# Altium schematic sheet STM32.SchDoc
size A4
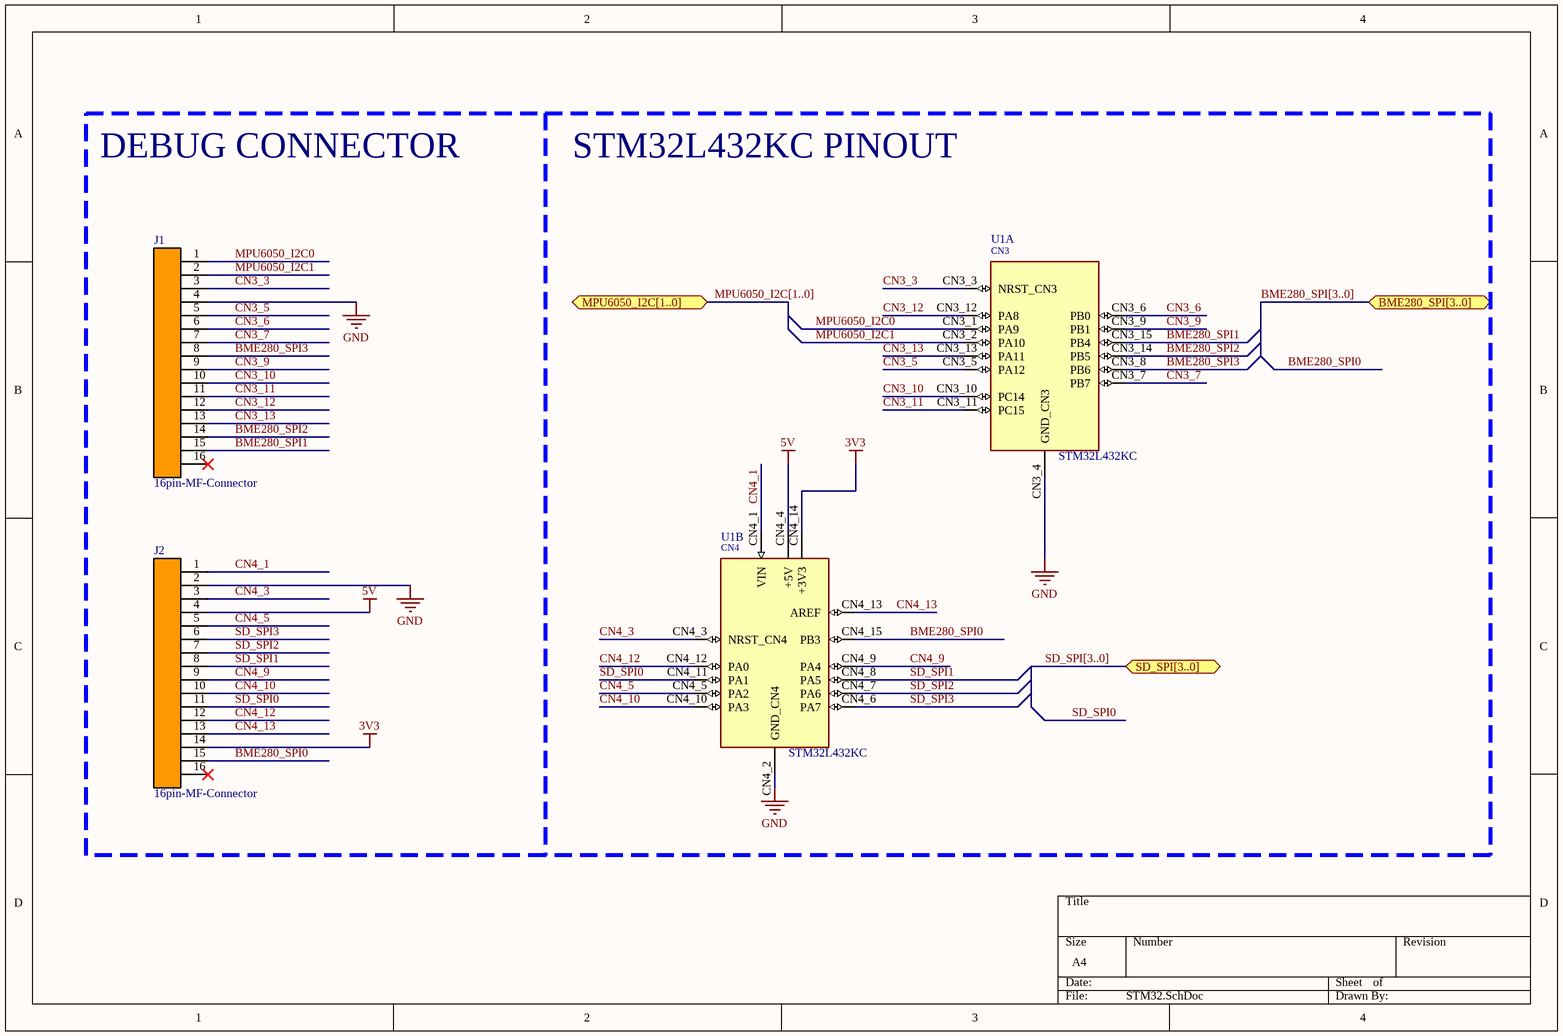
[diagram p0: STM32.SchDoc]

## Parts
J1  16pin-MF-Connector  [16pin-MF-Connector]
J2  16pin-MF-Connector  [16pin-MF-Connector]
U1  STM32L432KC  [STM32L432KC]  (parts A,B of 2)

## Blocks framed on the sheet
DEBUG CONNECTOR: J1 J2

## Ports
BME280_SPI[3..0] (bidir), MPU6050_I2C[1..0] (bidir), SD_SPI[3..0] (bidir)

## Nets
3V3: J2.14 U1.CN4_14(+3V3)
5V: J2.4 U1.CN4_4(+5V)
GND: J1.4 J2.2 U1.CN3_4(GND_CN3) U1.CN4_2(GND_CN4)
BME280_SPI0: J2.15 U1.CN4_15(PB3)
BME280_SPI1: J1.15 U1.CN3_15(PB4)
BME280_SPI2: J1.14 U1.CN3_14(PB5)
BME280_SPI3: J1.8 U1.CN3_8(PB6)
CN3_3: J1.3 U1.CN3_3(NRST_CN3)
CN3_5: J1.5 U1.CN3_5(PA12)
CN3_6: J1.6 U1.CN3_6(PB0)
CN3_7: J1.7 U1.CN3_7(PB7)
CN3_9: J1.9 U1.CN3_9(PB1)
CN3_10: J1.10 U1.CN3_10(PC14)
CN3_11: J1.11 U1.CN3_11(PC15)
CN3_12: J1.12 U1.CN3_12(PA8)
CN3_13: J1.13 U1.CN3_13(PA11)
CN4_1: J2.1 U1.CN4_1(VIN)
CN4_3: J2.3 U1.CN4_3(NRST_CN4)
CN4_5: J2.5 U1.CN4_5(PA2)
CN4_9: J2.9 U1.CN4_9(PA4)
CN4_10: J2.10 U1.CN4_10(PA3)
CN4_12: J2.12 U1.CN4_12(PA0)
CN4_13: J2.13 U1.CN4_13(AREF)
MPU6050_I2C0: J1.1 U1.CN3_1(PA9)
MPU6050_I2C1: J1.2 U1.CN3_2(PA10)
SD_SPI0: J2.11 U1.CN4_11(PA1)
SD_SPI1: J2.8 U1.CN4_8(PA5)
SD_SPI2: J2.7 U1.CN4_7(PA6)
SD_SPI3: J2.6 U1.CN4_6(PA7)

Not connected (* = marked no-connect by the designer): J1 16*; J2 16*

## Buses and harness runs
bus BME280_SPI[3..0] = port BME280_SPI[3..0]
bus MPU6050_I2C[1..0] = port MPU6050_I2C[1..0]
bus SD_SPI[3..0] = port SD_SPI[3..0]

## Notes on the sheet
- STM32L432KC PINOUT
- (in symbol STM32L432KC, part A) CN3
- (in symbol STM32L432KC, part B) CN4